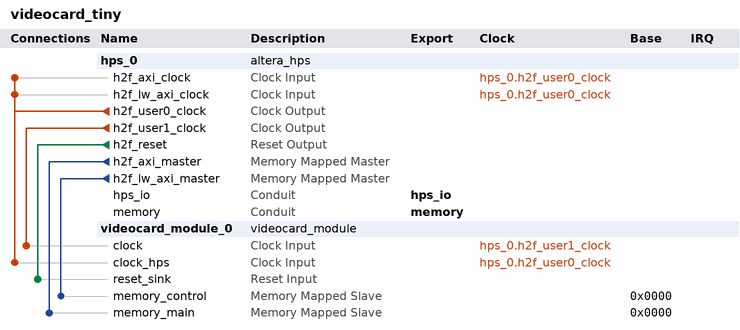
[diagram p0: system contents]
# Platform Designer (Qsys) system videocard_tiny, Cyclone V 5CSEBA6U23I7
# Parameters at their usual value, and those the tool derives, are not listed.
package require -exact qsys 20.1
create_system videocard_tiny
set_project_property DEVICE_FAMILY {Cyclone V}
set_project_property DEVICE 5CSEBA6U23I7

add_instance hps_0 altera_hps 20.1
set_instance_parameter_value hps_0 CAN0_Mode CAN
set_instance_parameter_value hps_0 CAN0_PinMuxing {HPS I/O Set 0}
set_instance_parameter_value hps_0 EMAC1_Mode RGMII
set_instance_parameter_value hps_0 EMAC1_PinMuxing {HPS I/O Set 0}
set_instance_parameter_value hps_0 F2SCLK_COLDRST_Enable false
set_instance_parameter_value hps_0 F2SCLK_DBGRST_Enable false
set_instance_parameter_value hps_0 F2SCLK_WARMRST_Enable false
set_instance_parameter_value hps_0 F2SINTERRUPT_Enable false
set_instance_parameter_value hps_0 F2S_Width 0
set_instance_parameter_value hps_0 FPGA_PERIPHERAL_OUTPUT_CLOCK_FREQ_EMAC0_GTX_CLK 125
set_instance_parameter_value hps_0 FPGA_PERIPHERAL_OUTPUT_CLOCK_FREQ_EMAC0_MD_CLK 2.5
set_instance_parameter_value hps_0 FPGA_PERIPHERAL_OUTPUT_CLOCK_FREQ_EMAC1_GTX_CLK 125
set_instance_parameter_value hps_0 FPGA_PERIPHERAL_OUTPUT_CLOCK_FREQ_EMAC1_MD_CLK 2.5
set_instance_parameter_value hps_0 HPS_PROTOCOL DDR3
set_instance_parameter_value hps_0 I2C0_Mode I2C
set_instance_parameter_value hps_0 I2C0_PinMuxing {HPS I/O Set 0}
set_instance_parameter_value hps_0 I2C1_Mode I2C
set_instance_parameter_value hps_0 I2C1_PinMuxing {HPS I/O Set 0}
set_instance_parameter_value hps_0 LWH2F_Enable true
set_instance_parameter_value hps_0 MEM_BANKADDR_WIDTH 3
set_instance_parameter_value hps_0 MEM_CLK_FREQ 300.0
set_instance_parameter_value hps_0 MEM_CLK_FREQ_MAX 400.0
set_instance_parameter_value hps_0 MEM_COL_ADDR_WIDTH 8
set_instance_parameter_value hps_0 MEM_DQ_WIDTH 8
set_instance_parameter_value hps_0 MEM_DRV_STR RZQ/6
set_instance_parameter_value hps_0 MEM_ROW_ADDR_WIDTH 12
set_instance_parameter_value hps_0 MEM_RTT_NOM RZQ/6
set_instance_parameter_value hps_0 MEM_RTT_WR {Dynamic ODT off}
set_instance_parameter_value hps_0 MEM_TCL 7
set_instance_parameter_value hps_0 MEM_TFAW_NS 37.5
set_instance_parameter_value hps_0 MEM_TINIT_US 499
set_instance_parameter_value hps_0 MEM_TMRD_CK 3
set_instance_parameter_value hps_0 MEM_TRAS_NS 40.0
set_instance_parameter_value hps_0 MEM_TRCD_NS 15.0
set_instance_parameter_value hps_0 MEM_TREFI_US 7.0
set_instance_parameter_value hps_0 MEM_TRFC_NS 75.0
set_instance_parameter_value hps_0 MEM_TRP_NS 15.0
set_instance_parameter_value hps_0 MEM_TWTR 2
set_instance_parameter_value hps_0 MEM_VENDOR JEDEC
set_instance_parameter_value hps_0 MEM_WTCL 6
set_instance_parameter_value hps_0 QSPI_Mode {1 SS}
set_instance_parameter_value hps_0 QSPI_PinMuxing {HPS I/O Set 1}
set_instance_parameter_value hps_0 REF_CLK_FREQ 125.0
set_instance_parameter_value hps_0 S2FCLK_USER0CLK_Enable true
set_instance_parameter_value hps_0 S2FCLK_USER1CLK_Enable true
set_instance_parameter_value hps_0 S2FCLK_USER1CLK_FREQ 5.0
set_instance_parameter_value hps_0 S2FCLK_USER2CLK 5
set_instance_parameter_value hps_0 S2F_Width 1
set_instance_parameter_value hps_0 SDIO_Mode {4-bit Data}
set_instance_parameter_value hps_0 SDIO_PinMuxing {HPS I/O Set 0}
set_instance_parameter_value hps_0 SPIM0_Mode {Single Slave Select}
set_instance_parameter_value hps_0 SPIM0_PinMuxing {HPS I/O Set 0}
set_instance_parameter_value hps_0 SPIM1_Mode {Single Slave Select}
set_instance_parameter_value hps_0 SPIM1_PinMuxing {HPS I/O Set 0}
set_instance_parameter_value hps_0 STM_Enable false
set_instance_parameter_value hps_0 TIMING_BOARD_AC_SKEW 0.02
set_instance_parameter_value hps_0 TIMING_BOARD_AC_TO_CK_SKEW 0.0
set_instance_parameter_value hps_0 TIMING_BOARD_DQ_TO_DQS_SKEW 0.0
set_instance_parameter_value hps_0 TIMING_BOARD_MAX_CK_DELAY 0.6
set_instance_parameter_value hps_0 TIMING_BOARD_MAX_DQS_DELAY 0.6
set_instance_parameter_value hps_0 TIMING_BOARD_SKEW_BETWEEN_DQS 0.02
set_instance_parameter_value hps_0 TIMING_BOARD_SKEW_CKDQS_DIMM_MAX 0.01
set_instance_parameter_value hps_0 TIMING_BOARD_SKEW_CKDQS_DIMM_MIN -0.01
set_instance_parameter_value hps_0 TIMING_BOARD_SKEW_WITHIN_DQS 0.02
set_instance_parameter_value hps_0 TIMING_TDH 125
set_instance_parameter_value hps_0 TIMING_TDQSCK 400
set_instance_parameter_value hps_0 TIMING_TDQSQ 120
set_instance_parameter_value hps_0 TIMING_TDS 50
set_instance_parameter_value hps_0 TIMING_TIH 250
set_instance_parameter_value hps_0 TIMING_TIS 175
set_instance_parameter_value hps_0 TIMING_TQSH 0.38
set_instance_parameter_value hps_0 UART0_Mode {No Flow Control}
set_instance_parameter_value hps_0 UART0_PinMuxing {HPS I/O Set 0}
set_instance_parameter_value hps_0 USB1_Mode SDR
set_instance_parameter_value hps_0 USB1_PinMuxing {HPS I/O Set 0}
set_instance_parameter_value hps_0 desired_cfg_clk_mhz 100.0
set_instance_parameter_value hps_0 desired_qspi_clk_mhz 400.0

add_instance videocard_module_0 videocard_module 1.0
set_instance_parameter_value videocard_module_0 BYTES 4
set_instance_parameter_value videocard_module_0 WIDTH 32

# connections
add_connection hps_0.h2f_user0_clock hps_0.h2f_axi_clock clock
add_connection hps_0.h2f_user0_clock hps_0.h2f_lw_axi_clock clock
add_connection hps_0.h2f_user0_clock videocard_module_0.clock_hps clock
add_connection hps_0.h2f_user1_clock videocard_module_0.clock clock
add_connection hps_0.h2f_reset videocard_module_0.reset_sink reset
add_connection hps_0.h2f_axi_master videocard_module_0.memory_main avalon
set_connection_parameter_value hps_0.h2f_axi_master/videocard_module_0.memory_main baseAddress 0x0000
add_connection hps_0.h2f_lw_axi_master videocard_module_0.memory_control avalon
set_connection_parameter_value hps_0.h2f_lw_axi_master/videocard_module_0.memory_control baseAddress 0x0000

# exported interfaces
add_interface hps_io conduit end
set_interface_property hps_io EXPORT_OF hps_0.hps_io
add_interface memory conduit end
set_interface_property memory EXPORT_OF hps_0.memory

set_interconnect_requirement {$system} qsys_mm.clockCrossingAdapter HANDSHAKE
set_interconnect_requirement {$system} qsys_mm.enableEccProtection FALSE
set_interconnect_requirement {$system} qsys_mm.insertDefaultSlave FALSE
set_interconnect_requirement {$system} qsys_mm.maxAdditionalLatency 1

save_system videocard_tiny.qsys
